# Altium schematic sheet Condor2a_Pin_REV_C.SchDoc
size A4; DrawnBy: Philip Rowse
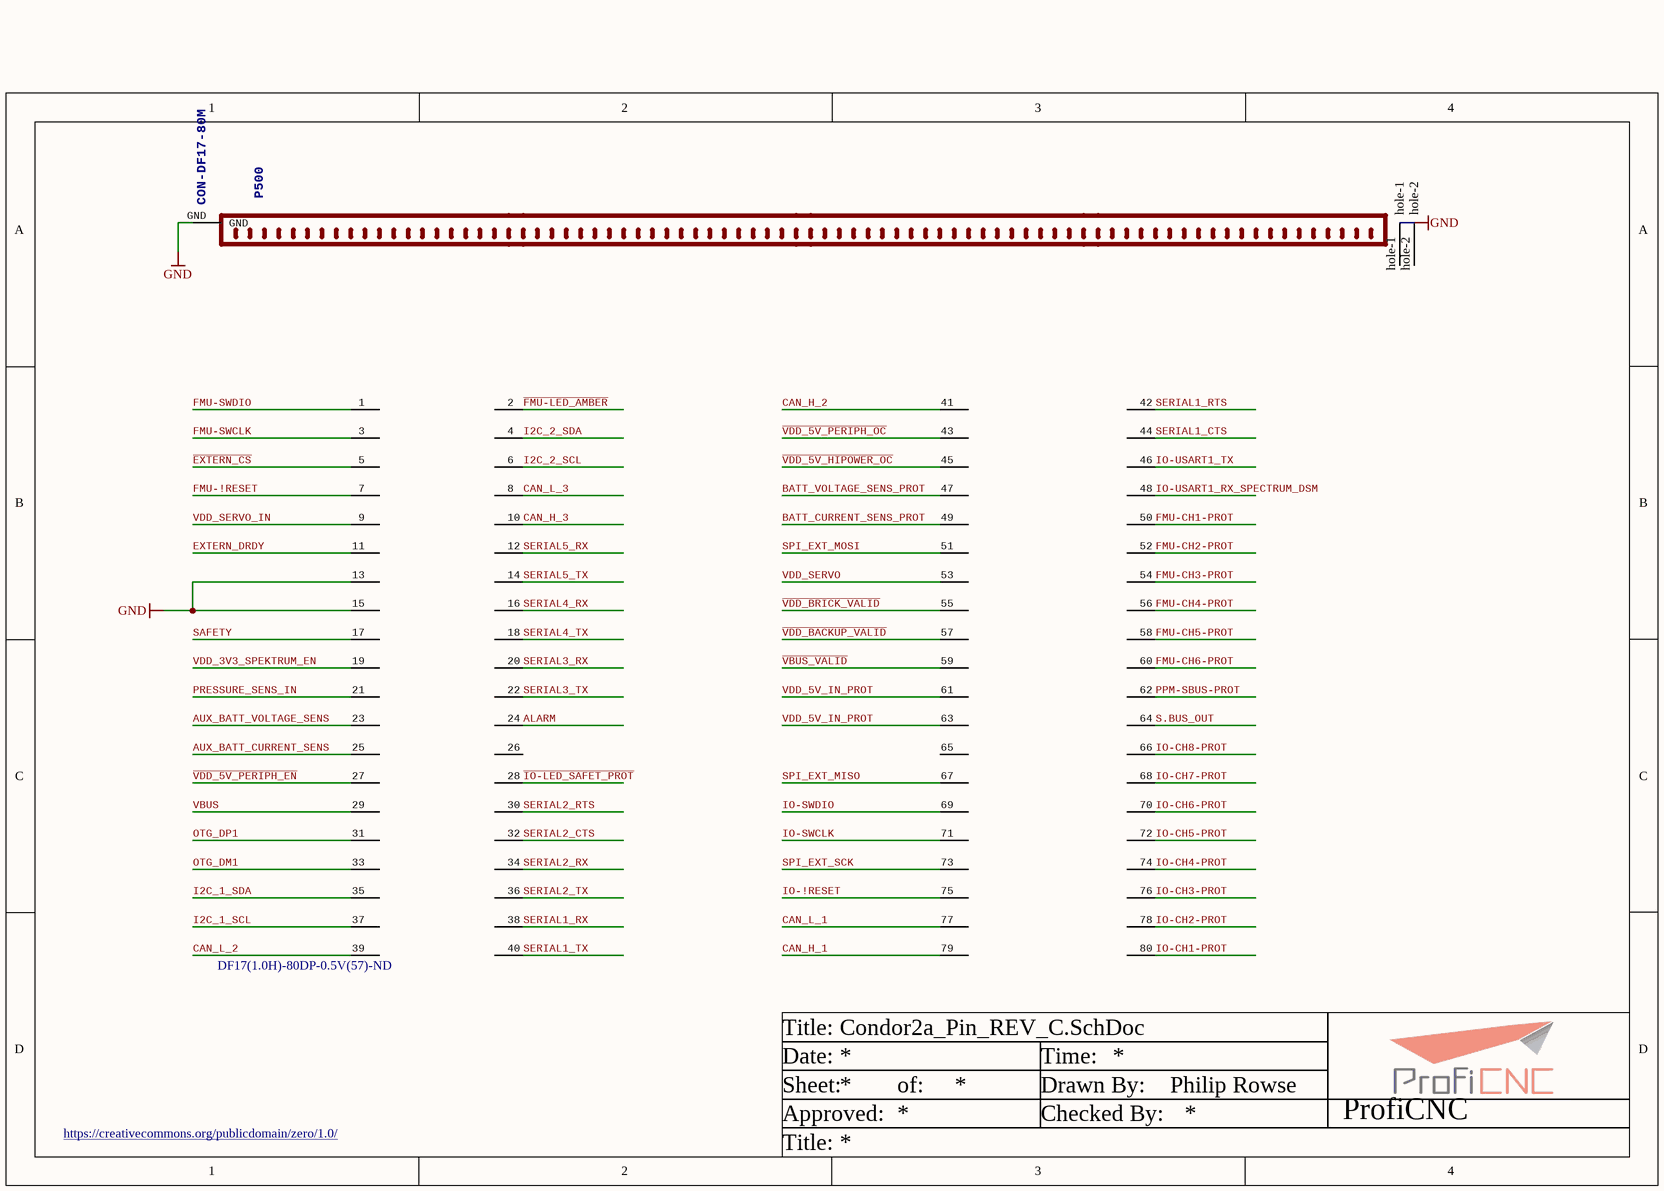
[diagram p0: Condor2a_Pin_REV_C.SchDoc]

## Parts
P500  CON-DF17-80M  Supplier Part Number 1: DF17(1.0H)-80DP-0.5V(57)-ND  [CON-DF17-80M]

## Nets
GND: P500.13 P500.15 P500.GND
ALARM: P500.24
AUX_BATT_CURRENT_SENS: P500.25
AUX_BATT_VOLTAGE_SENS: P500.23
BATT_CURRENT_SENS_PROT: P500.49
BATT_VOLTAGE_SENS_PROT: P500.47
CAN_H_1: P500.79
CAN_H_2: P500.41
CAN_H_3: P500.10
CAN_L_1: P500.77
CAN_L_2: P500.39
CAN_L_3: P500.8
~{EXTERN_CS}: P500.5
EXTERN_DRDY: P500.11
~{FMU-LED_AMBER}: P500.2
FMU-!RESET: P500.7
FMU-CH1-PROT: P500.50
FMU-CH2-PROT: P500.52
FMU-CH3-PROT: P500.54
FMU-CH4-PROT: P500.56
FMU-CH5-PROT: P500.58
FMU-CH6-PROT: P500.60
FMU-SWCLK: P500.3
FMU-SWDIO: P500.1
I2C_1_SCL: P500.37
I2C_1_SDA: P500.35
I2C_2_SCL: P500.6
I2C_2_SDA: P500.4
~{IO-LED_SAFET_PROT}: P500.28
IO-!RESET: P500.75
IO-CH1-PROT: P500.80
IO-CH2-PROT: P500.78
IO-CH3-PROT: P500.76
IO-CH4-PROT: P500.74
IO-CH5-PROT: P500.72
IO-CH6-PROT: P500.70
IO-CH7-PROT: P500.68
IO-CH8-PROT: P500.66
IO-SWCLK: P500.71
IO-SWDIO: P500.69
IO-USART1_RX_SPECTRUM_DSM: P500.48
IO-USART1_TX: P500.46
OTG_DM1: P500.33
OTG_DP1: P500.31
PPM-SBUS-PROT: P500.62
PRESSURE_SENS_IN: P500.21
S.BUS_OUT: P500.64
SAFETY: P500.17
SERIAL1_CTS: P500.44
SERIAL1_RTS: P500.42
SERIAL1_RX: P500.38
SERIAL1_TX: P500.40
SERIAL2_CTS: P500.32
SERIAL2_RTS: P500.30
SERIAL2_RX: P500.34
SERIAL2_TX: P500.36
SERIAL3_RX: P500.20
SERIAL3_TX: P500.22
SERIAL4_RX: P500.16
SERIAL4_TX: P500.18
SERIAL5_RX: P500.12
SERIAL5_TX: P500.14
SPI_EXT_MISO: P500.67
SPI_EXT_MOSI: P500.51
SPI_EXT_SCK: P500.73
~{VBUS_VALID}: P500.59
~{VDD_5V_HIPOWER_OC}: P500.45
~{VDD_5V_PERIPH_EN}: P500.27
~{VDD_5V_PERIPH_OC}: P500.43
~{VDD_BACKUP_VALID}: P500.57
~{VDD_BRICK_VALID}: P500.55
VBUS: P500.29
VDD_3V3_SPEKTRUM_EN: P500.19
VDD_5V_IN_PROT: P500.61 P500.63
VDD_SERVO: P500.53
VDD_SERVO_IN: P500.9

Not connected (* = marked no-connect by the designer): P500 26 65 hole-1 hole-2

## Notes on the sheet
- Title:
- Date:
- Time:
- https://creativecommons.org/publicdomain/zero/1.0/
- Sheet:
- Approved:
- of:
- Drawn By:
- Checked By:
- ProfiCNC

## Library data of the parts
P500 = CON-DF17-80M: Connector, Header, 80Pos, .5MM, DUAL, SMD, Au; Supplier 1: Digi-Key